# EAGLE design receiver (EAGLE 6.5.0)

## Sheet 1 of 5: Raspberry PI 2 Extention Board Documentation <http://elinux.org/RPi_Low-level_peripherals#Model_A.2B.2C_B.2B_and_B2>
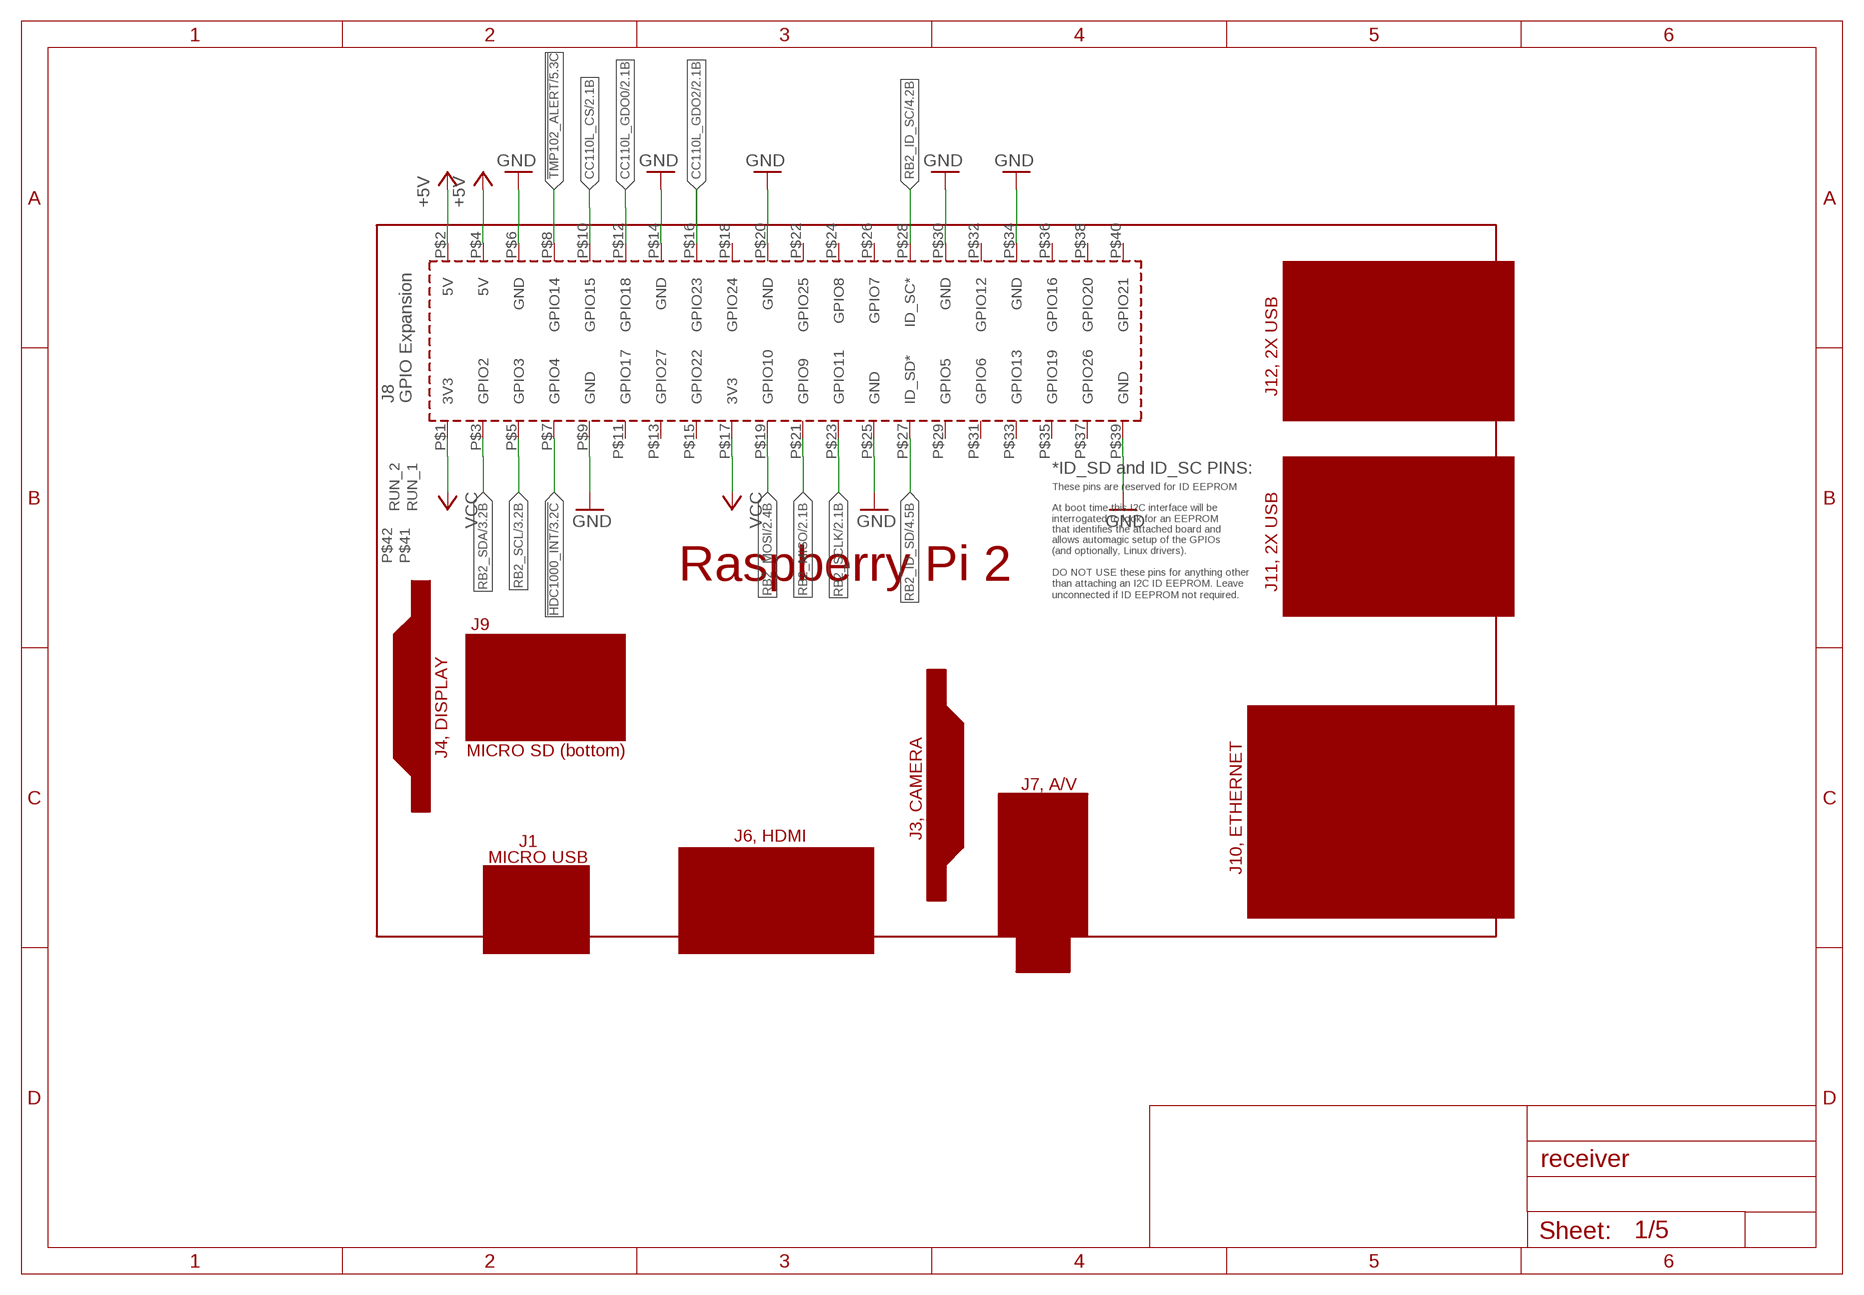
[diagram p0: schematic, sheet 1]

### Parts
PCB1  RPI2  [RPI2]

### Nets
!HDC1000_INT: PCB1.P$7(GPIO4) ; also sheet 3
!TMP102_ALERT: PCB1.P$8(GPIO14) ; also sheet 5
+5V: PCB1.P$2(5V) PCB1.P$4(5V)
CC110L_CS: PCB1.P$10(GPIO15) ; also sheet 2
CC110L_GDO0: PCB1.P$12(GPIO18) ; also sheet 2
CC110L_GDO2: PCB1.P$16(GPIO23) ; also sheet 2
GND: PCB1.P$6(GND) PCB1.P$9(GND) PCB1.P$14(GND) PCB1.P$20(GND) PCB1.P$25(GND) PCB1.P$30(GND) PCB1.P$34(GND) PCB1.P$39(GND) ; also sheet 2,3,4,5
RB2_ID_SC: PCB1.P$28(ID_SC*) ; also sheet 4
RB2_ID_SD: PCB1.P$27(ID_SD*) ; also sheet 4
RB2_MISO: PCB1.P$21(GPIO9) ; also sheet 2
RB2_MOSI: PCB1.P$19(GPIO10) ; also sheet 2
RB2_SCL: PCB1.P$5(GPIO3) ; also sheet 3,5
RB2_SCLK: PCB1.P$23(GPIO11) ; also sheet 2
RB2_SDA: PCB1.P$3(GPIO2) ; also sheet 3,5
VCC: PCB1.P$1(3V3) PCB1.P$17(3V3) ; also sheet 2,3,4,5
Unconnected: PCB1.P$11(GPIO17) PCB1.P$13(GPIO27) PCB1.P$15(GPIO22) PCB1.P$18(GPIO24) PCB1.P$22(GPIO25) PCB1.P$24(GPIO8) PCB1.P$26(GPIO7) PCB1.P$29(GPIO5) PCB1.P$31(GPIO6) PCB1.P$32(GPIO12) PCB1.P$33(GPIO13) PCB1.P$35(GPIO19) PCB1.P$36(GPIO16) PCB1.P$37(GPIO26) PCB1.P$38(GPIO20) PCB1.P$40(GPIO21) PCB1.P$41(RUN_1) PCB1.P$42(RUN_2)

## Sheet 2 of 5: Transceiver CC110L Datasheet <http://www.ti.com/lit/ds/symlink/cc110l.pdf>
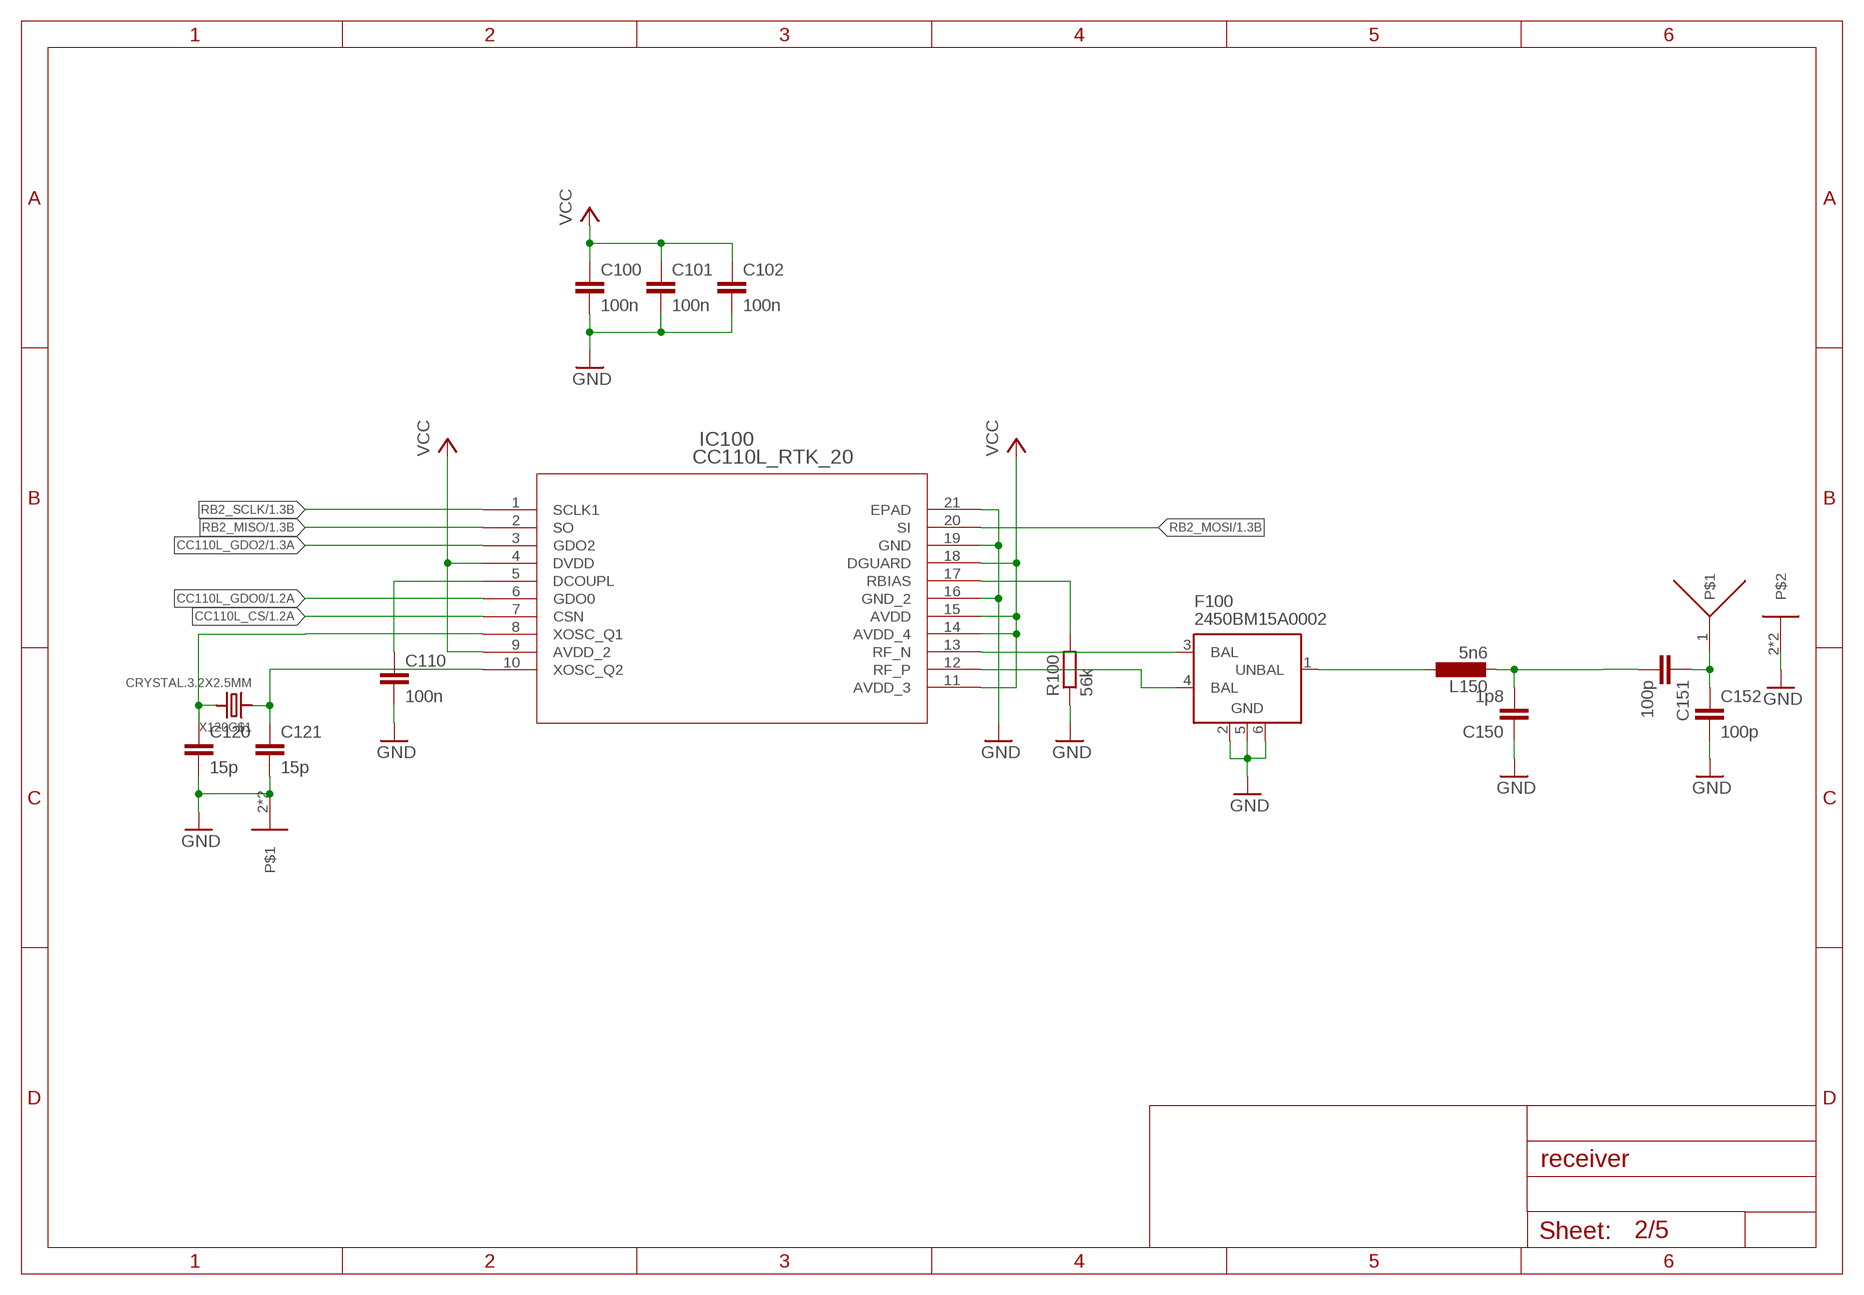
[diagram p1: schematic, sheet 2]

### Parts
C100  100n  C-EUC0603  [C0603]
C101  100n  C-EUC0603  [C0603]
C102  100n  C-EUC0603  [C0603]
C110  100n  C-EUC0603  [C0603]
C120  15p  C-EUC0603  [C0603]
C121  15p  C-EUC0603  [C0603]
C150  1p8  C-EUC0603K  [C0603K]
C151  100p  C-EUC0603  [C0603]
C152  100p  C-EUC0603K  [C0603K]
F100  2450BM15A0002  [2450BM15A0002]
IC100  CC110L_RTK_20  [RTK20_2P4X2P4]
L150  5n6  L-EUL2012C  [L2012C]
R100  56k  R-EU_R0603  [R0603]
U$1  ANTENNA868W3013-INV  [W3013-INV]
X120  CRYSTAL.3.2X2.5MM  [3.2X2.5MM]

### Nets
CC110L_CS: IC100.7(CSN) ; also sheet 1
CC110L_GDO0: IC100.6(GDO0) ; also sheet 1
CC110L_GDO2: IC100.3(GDO2) ; also sheet 1
GND: C100.2 C101.2 C102.2 C110.2 C120.2 C121.2 C150.1 C152.2 F100.2(GND) F100.5(GND) F100.6(GND) IC100.16(GND_2) IC100.19(GND) IC100.21(EPAD) R100.1 U$1.2 U$1.3 X120.2 X120.4 ; also sheet 1,3,4,5
N$2: C151.1 C152.1 U$1.1
N$29: C120.1 IC100.8(XOSC_Q1) X120.3
N$33: F100.1(UNBAL) L150.1
N$34: F100.3(BAL) IC100.13(RF_N)
N$35: F100.4(BAL) IC100.12(RF_P)
N$36: C150.2 C151.2 L150.2
N$40: C110.1 IC100.5(DCOUPL)
N$41: IC100.17(RBIAS) R100.2
N$49: C121.1 IC100.10(XOSC_Q2) X120.1
RB2_MISO: IC100.2(SO) ; also sheet 1
RB2_MOSI: IC100.20(SI) ; also sheet 1
RB2_SCLK: IC100.1(SCLK1) ; also sheet 1
VCC: C100.1 C101.1 C102.1 IC100.4(DVDD) IC100.9(AVDD_2) IC100.11(AVDD_3) IC100.14(AVDD_4) IC100.15(AVDD) IC100.18(DGUARD) ; also sheet 1,3,4,5

## Sheet 3 of 5: Humidity and Temperature Sensor HDC1000 Datascheet <http://www.ti.com/lit/ds/symlink/hdc1000.pdf>
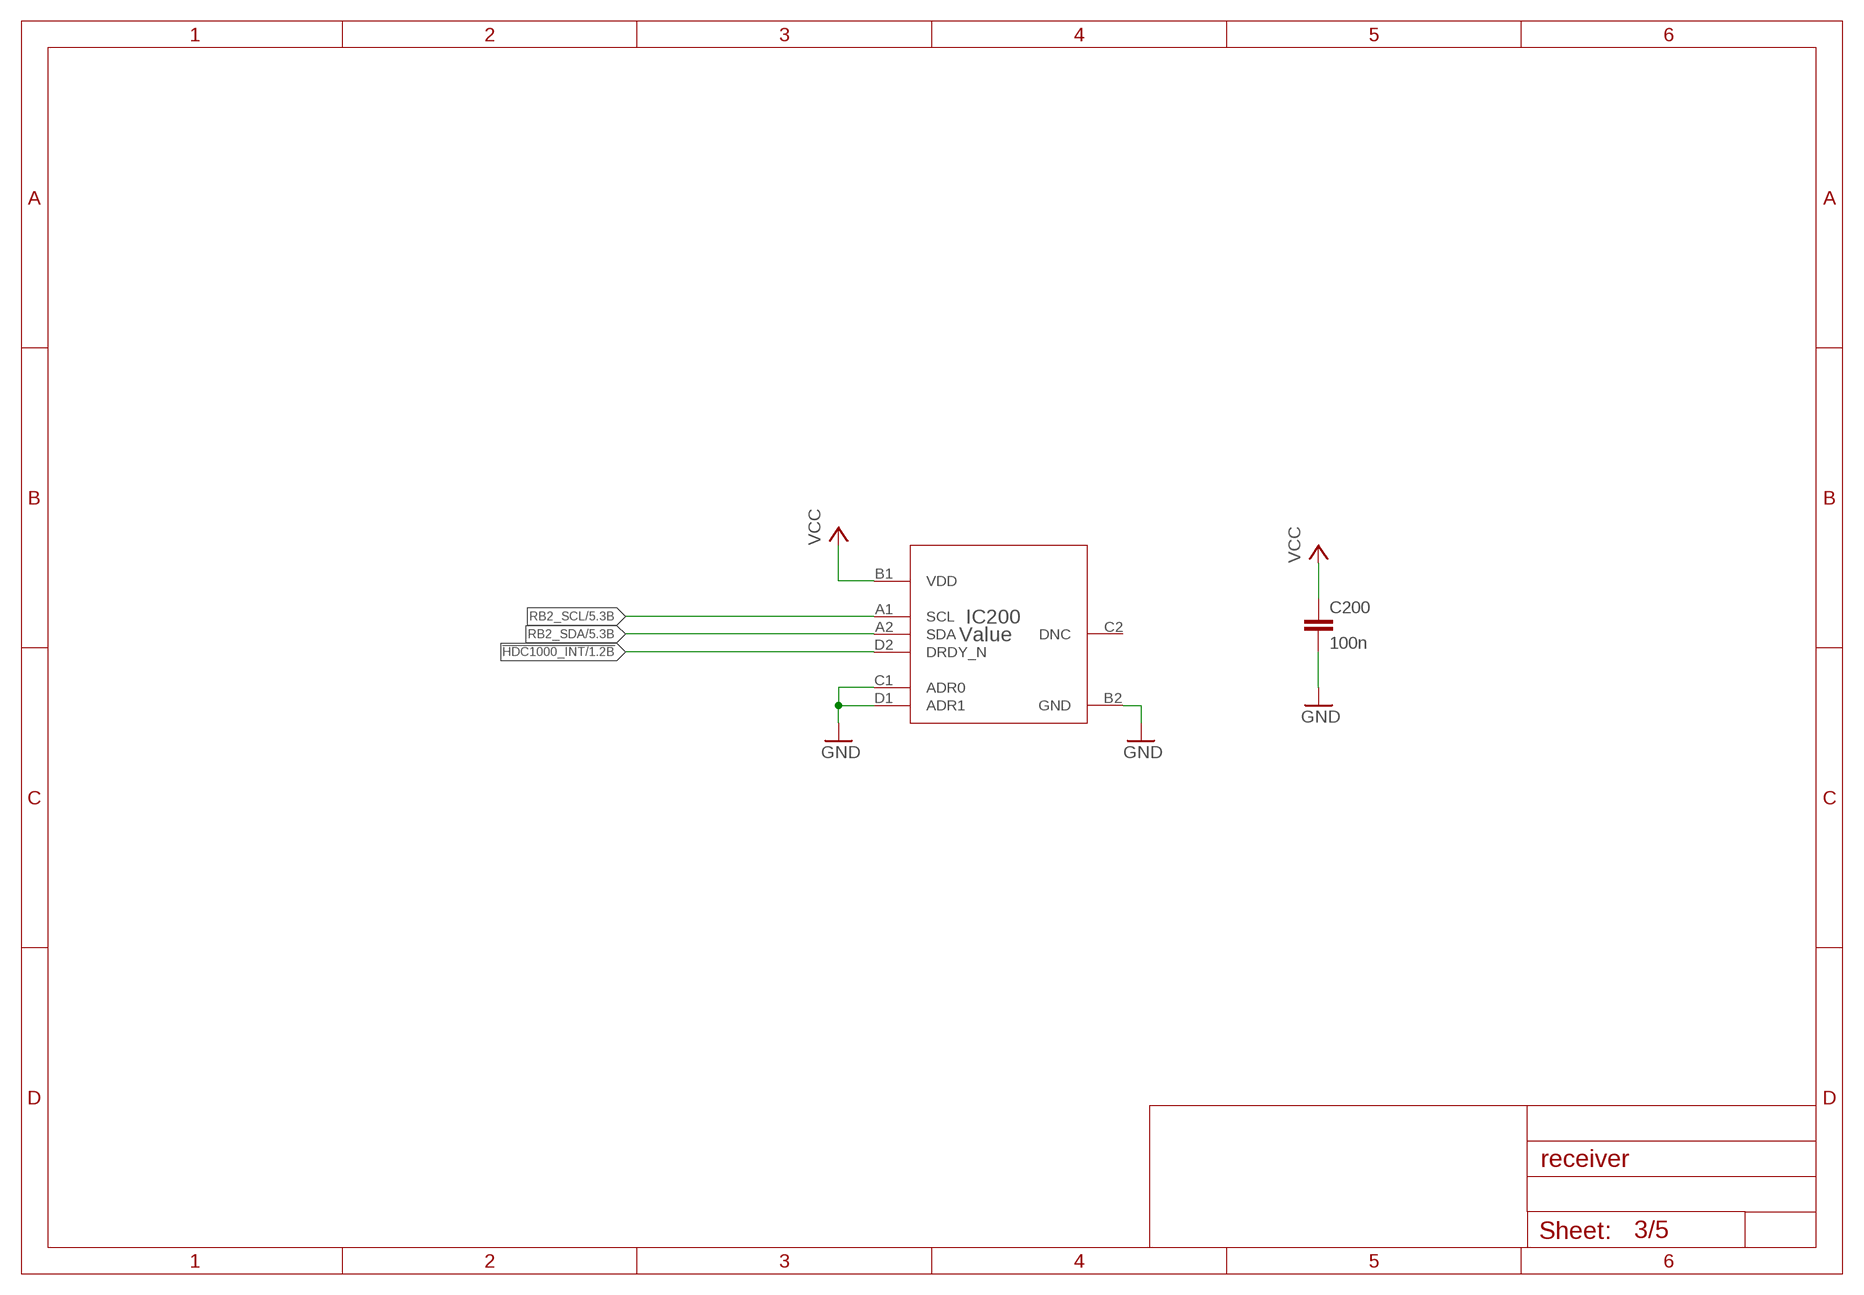
[diagram p2: schematic, sheet 3]

### Parts
C200  100n  C-EUC0603  [C0603]
IC200  Value  HDC1000YPAR  [YPA0008AGAE]

### Nets
!HDC1000_INT: IC200.D2(DRDY_N) ; also sheet 1
GND: C200.2 IC200.B2(GND) IC200.C1(ADR0) IC200.D1(ADR1) ; also sheet 1,2,4,5
RB2_SCL: IC200.A1(SCL) ; also sheet 1,5
RB2_SDA: IC200.A2(SDA) ; also sheet 1,5
VCC: C200.1 IC200.B1(VDD) ; also sheet 1,2,4,5
Unconnected: IC200.C2(DNC)

## Sheet 4 of 5: EEPROM CAT24C32WI Datasheet <http://www.onsemi.com/pub_link/Collateral/CAT24C32-D.PDF>
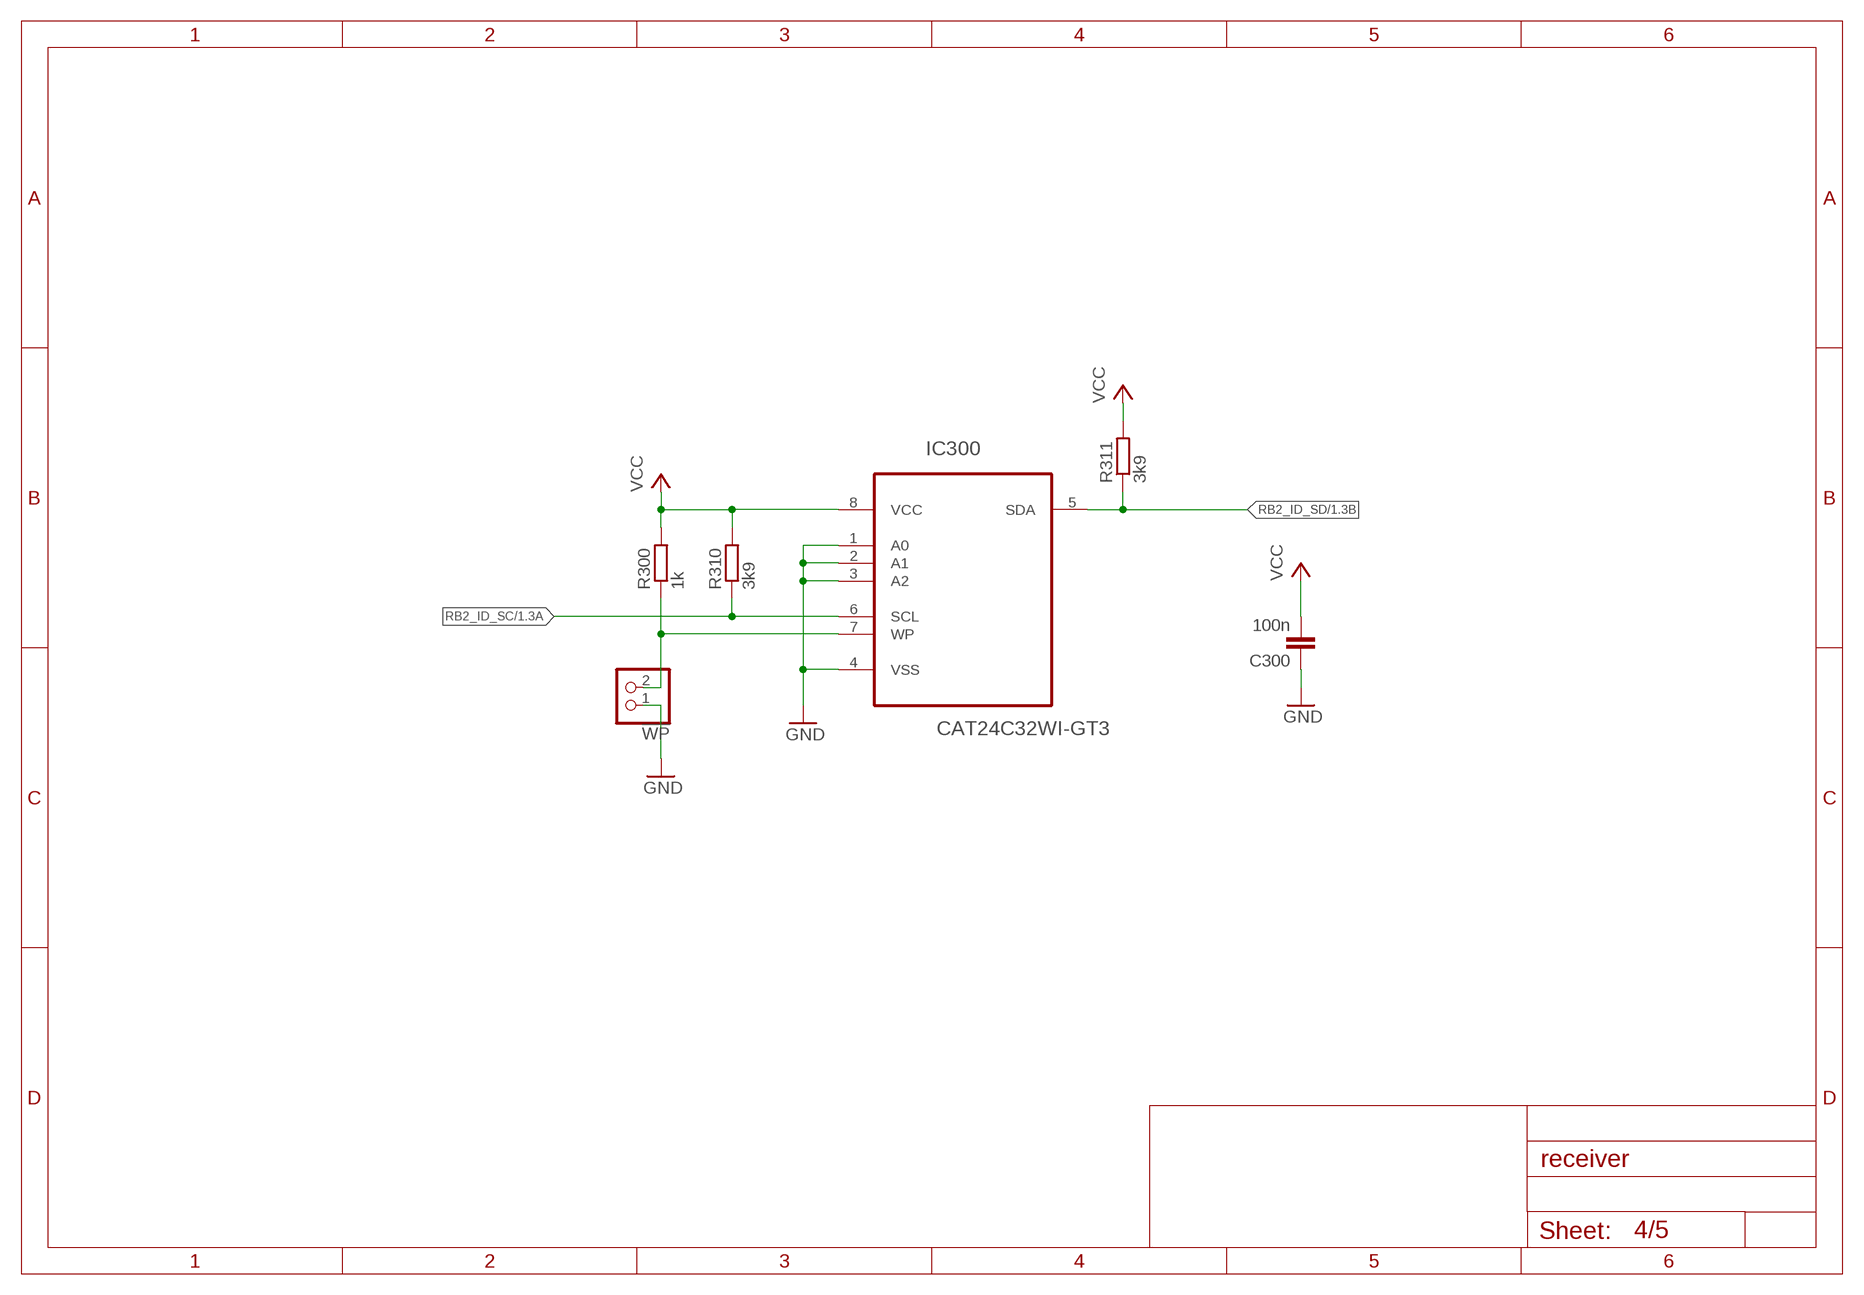
[diagram p3: schematic, sheet 4]

### Parts
!WP  PINHD-1X2  [1X02]
C300  100n  C-EUC0603  [C0603]
IC300  CAT24C32WI-GT3  [SOIC127P600X175-8N]
R300  1k  R-EU_R0603  [R0603]
R310  3k9  R-EU_R0603  [R0603]
R311  3k9  R-EU_R0603  [R0603]

### Nets
GND: !WP.1 C300.1 IC300.1(A0) IC300.2(A1) IC300.3(A2) IC300.4(VSS) ; also sheet 1,2,3,5
N$1: !WP.2 IC300.7(WP) R300.1
RB2_ID_SC: IC300.6(SCL) R310.1 ; also sheet 1
RB2_ID_SD: IC300.5(SDA) R311.1 ; also sheet 1
VCC: C300.2 IC300.8(VCC) R300.2 R310.2 R311.2 ; also sheet 1,2,3,5

## Sheet 5 of 5: Temperature Sensor Datasheet <http://www.ti.com/lit/ds/symlink/tmp102-q1.pdf>
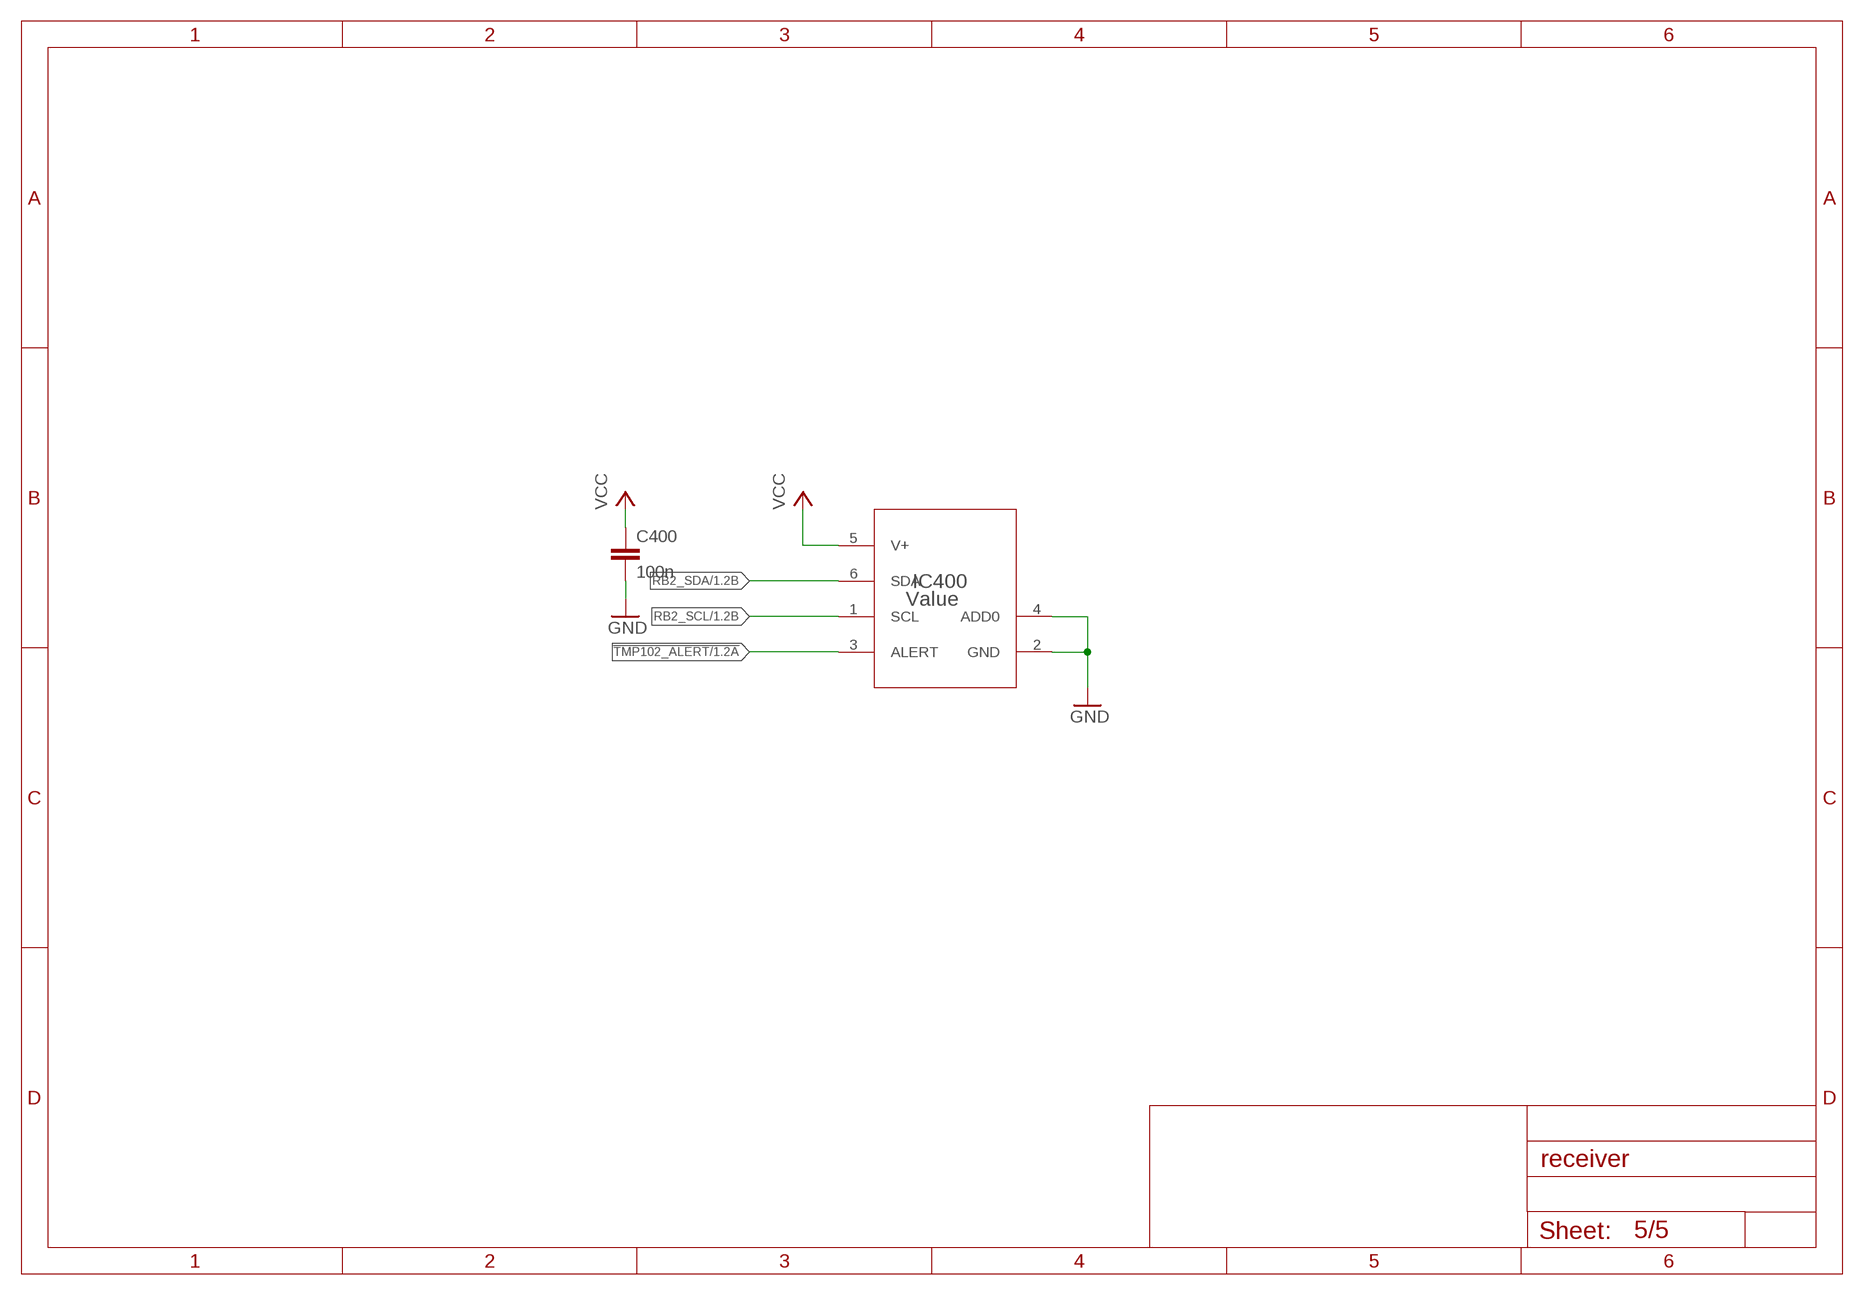
[diagram p4: schematic, sheet 5]

### Parts
C400  100n  C-EUC0603  [C0603]
IC400  Value  TMP102AQDRLRQ1  [DRL0006A]

### Nets
!TMP102_ALERT: IC400.3(ALERT) ; also sheet 1
GND: C400.2 IC400.2(GND) IC400.4(ADD0) ; also sheet 1,2,3,4
RB2_SCL: IC400.1(SCL) ; also sheet 1,3
RB2_SDA: IC400.6(SDA) ; also sheet 1,3
VCC: C400.1 IC400.5(V+) ; also sheet 1,2,3,4

## Library data of the parts
!WP = pinhead:PINHD-1X2: PIN HEADER
C100-C102 C110 C120 C121 C150-C152 C200 C300 C400 = rcl:C-EU: CAPACITOR, European symbol
F100 = johanson-technology:2450BM15A0002: 2.45 GHz Impedance Matched Balun-Filter For TI CC253X/CC2540 Chipset family Data sheet <http://www.johansontechnology.com/images/stories/ip/baluns/balun_filter_combo_matched_2450bm15a0002_v8.pdf>
IC100 = weather_station:CC110L_RTK_20; DATASHEETURL: http://www.ti.com/lit/gpn/CC110L; DESCRIPTION: Value Line Transceiver; FAMILY_NAME: SUB-1 GHZ; GENERIC_PART_NUMBER: CC110L; INDUSTRY_STD_PKG_TYPE: VQFN; MANUFACTURER: Texas Instruments; PACKAGE_DESIGNATOR: RTK; PIN_COUNT: 20
IC200 = weather_station:HDC1000YPAR; ALTERNATEPARTNUMBER: HDC1000YPAT; COMPTYPE: IC; MANUFACTURER: Texas Instruments; MOUNTTYPE: SMT; PACKAGEREFERENCE: YPA0008AGAE; PARTNUMBER: HDC1000YPAR; PIN_COUNT: 8; REFDES: RefDes; ROHS: Y; TYPE: TYPE
IC300 = weather_station:CAT24C32WI-GT3: 32-Kb I2C CMOS Serial EEPROM; MPN: CAT24C32WI-GT3; OC_FARNELL: 1718129; OC_NEWARK: 08R5414; PACKAGE: SOIC-8; SUPPLIER: CATALYST SEMICONDUCTOR
IC400 = weather_station:TMP102AQDRLRQ1; COMPTYPE: IC; MANUFACTURER: Texas Instruments; MOUNTTYPE: SMT; PACKAGEREFERENCE: DRL0006A; PARTNUMBER: TMP102AQDRLRQ1; PIN_COUNT: 6; REFDES: RefDes; ROHS: Y; TYPE: TYPE
L150 = rcl:L-EU: INDUCTOR, European symbol
PCB1 = weather_station:RPI2: Device for Raspberry Pi 2 board created by www.element14.com More information and support community is available at http://www.element14.com/community/community/raspberry-pi/raspberrypi2
R100 R300 R310 R311 = rcl:R-EU_: RESISTOR, European symbol
U$1 = weather_station:ANTENNA868
X120 = abracon:CRYSTAL

## Board
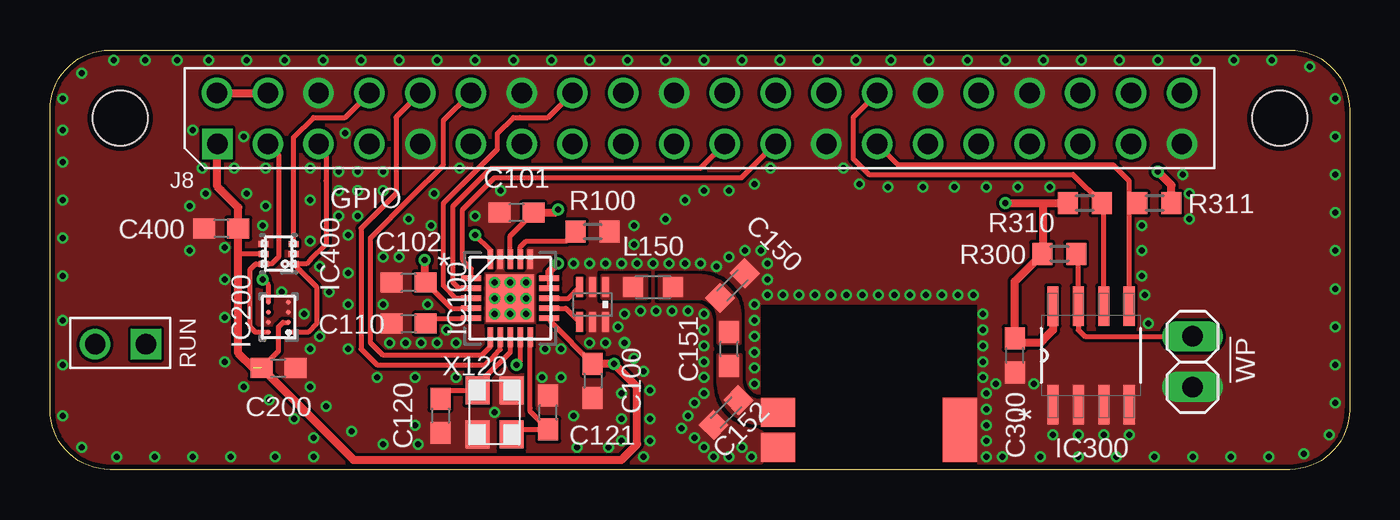
[diagram p5: board, top side]
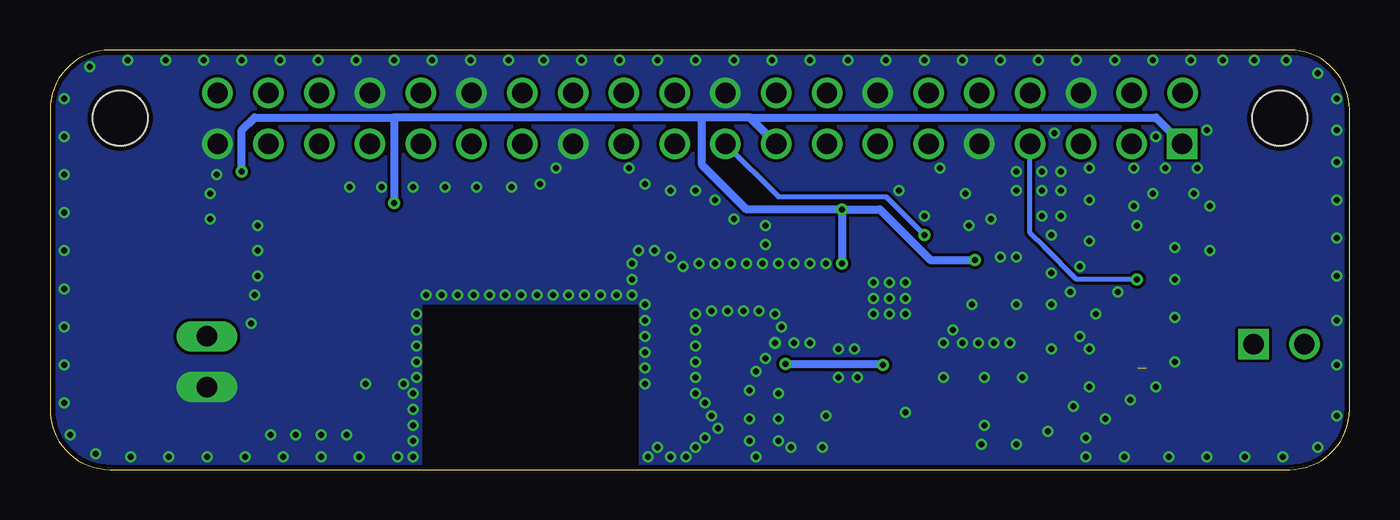
[diagram p6: board, bottom side, seen from below]

Size 65 x 21 mm. Coordinates in mm from the lower left corner, seen from the top.
Outline: 0,18 arc-90 3,21 62,21 arc-90 65,18 65,3 arc-90 62,0 3,0 arc-90 0,3 0,18
Copper layers (1*16): Top 0.018mm / dielectric 1.55mm / Bottom 0.018mm
Design rules "eC_2Layer_PClass6_BaseCopperO18_eCDefault *": minimum track width 0.15mm, minimum drill 0.3mm, track to track 0.15mm, track to pad 0.15mm, pad to pad 0.15mm, via to via 0.15mm, smd to smd 0.15mm, copper to edge 0.25mm, drill to drill 0.35mm, minimum pad ring 0.175mm, minimum via ring 0.125mm, stop-mask expansion 0mil, vias tented up to drill 0.45mm, thermal gap 0.2mm

### Footprints (pad centres in the part's own frame; a part is rotated, then mirrored left to right if it is on the bottom)
1X02 = drill 1.016 long: 1 -1.27,0; 2 1.27,0
C0603 = smd 1.1 x 1: 1 -0.85,0; 2 0.85,0
C0603K = smd 1.05 x 1.08: 1 -0.875,0; 2 0.875,0
2450BM15A0002 = smd 0.35 x 1: 1 -0.65,-0.875; 2 0,-0.875; 3 0.65,-0.875; 4 0.65,0.875; 5 0,0.875; 6 -0.65,0.875
RTK20_2P4X2P4 = smd 0.991 x 0.279: 1 -1.95,1; 2 -1.95,0.5; 3 -1.95,0; 4 -1.95,-0.5; 5 -1.95,-1; 11 1.95,-1; 12 1.95,-0.5; 13 1.95,0; 14 1.95,0.5; 15 1.95,1 | smd 0.279 x 0.991: 6 -1,-1.95; 7 -0.5,-1.95; 8 0,-1.95; 9 0.5,-1.95; 10 1,-1.95; 16 1,1.95; 17 0.5,1.95; 18 0,1.95; 19 -0.5,1.95; 20 -1,1.95 | smd 2.388 x 2.388: 21 0,0
YPA0008AGAE = smd 0.254 x 0.254: A1 -0.5,0.75; A2 0.5,0.75; B1 -0.5,0.25; B2 0.5,0.25; C1 -0.5,-0.25; C2 0.5,-0.25; D1 -0.5,-0.75; D2 0.5,-0.75
SOIC127P600X175-8N = smd 1.981 x 0.559: 1 -2.464,1.905; 2 -2.464,0.635; 3 -2.464,-0.635; 4 -2.464,-1.905; 5 2.464,-1.905; 6 2.464,-0.635; 7 2.464,0.635; 8 2.464,1.905
DRL0006A = smd 0.508 x 0.305: 1 -0.75,0.5; 2 -0.75,0; 3 -0.75,-0.5; 4 0.75,-0.5; 5 0.75,0; 6 0.75,0.5
L2012C = smd 1 x 1: 1 -1,0; 2 1,0
RPI2 = drill 1.016 square: P$1 8.37,51.23; P$41 4.8,41.2 | drill 1.016: P$2 8.357,53.772; P$3 10.897,51.232; P$4 10.897,53.772; P$5 13.437,51.232; P$6 13.437,53.772; P$7 15.977,51.232; P$8 15.977,53.772; P$9 18.517,51.232; P$10 18.517,53.772; P$11 21.057,51.232; P$12 21.057,53.772; P$13 23.597,51.232; P$14 23.597,53.772; P$15 26.137,51.232; P$16 26.137,53.772; P$17 28.677,51.232; P$18 28.677,53.772; P$19 31.217,51.232; P$20 31.217,53.772; P$21 33.757,51.232; P$22 33.757,53.772; P$23 36.297,51.232; P$24 36.297,53.772; P$25 38.837,51.232; P$26 38.837,53.772; P$27 41.377,51.232; P$28 41.377,53.772; P$29 43.917,51.232; P$30 43.917,53.772; P$31 46.457,51.232; P$32 46.457,53.772; P$33 48.997,51.232; P$34 48.997,53.772; P$35 51.537,51.232; P$36 51.537,53.772; P$37 54.077,51.232; P$38 54.077,53.772; P$39 56.617,51.232; P$40 56.617,53.772; P$42 2.26,41.2 | hole 2.75: 3.5,52.5; 61.5,52.5
R0603 = smd 1 x 1.1: 1 -0.85,0; 2 0.85,0
W3013-INV = smd 1.7 x 1.45: 1 0.845,2.875; 2 0.845,1.125 | smd 1.7 x 3.2: 3 9.945,2
3.2X2.5MM = smd 1.4 x 1.2: 1 -1.1,-0.85; 2 1.1,-0.85; 3 1.1,0.85; 4 -1.1,0.85

### Placement (x,y rotation side)
!WP  57.15,5.4 90 top
C100  27.15,4.45 270 top
C101  23.34,12.86 180 top
C102  17.94,9.37 180 top
C110  17.94,7.3 180 top
C120  19.53,2.7 270 top
C121  24.92,2.86 90 top
C150  34.13,9.21 225 top
C151  33.97,6.03 90 top
C152  33.81,2.86 225 top
C200  11.43,5.08 0 top
C300  48.26,5.71 90 top
C400  8.57,12.06 180 top
F100  27.15,8.26 180 top
IC100  23.02,8.57 0 top
IC200  11.43,7.62 180 top
IC300  52.07,5.71 90 top
IC400  11.43,10.79 180 top
L150  30.16,9.14 0 top
PCB1  0,-34.92 0 top
R100  27.15,11.91 180 top
R300  50.48,10.79 180 top
R310  51.75,13.34 180 top
R311  55.24,13.34 0 top
U$1  35.56,0 0 top
X120  22.23,2.86 90 top

### Tracks (layer width: path | path; a pad name or v marks a point on that pad's centre or on a via)
!HDC1000_INT  (via drill 0.3 pad 0.6)
  Top 0.254: IC200.D2 10.93,9.23 v10.64,9.53
  Bottom 0.254: v10.64,9.53 13.65,9.53 15.24,11.11 15.98,11.85 PCB1.P$7
!TMP102_ALERT
  Top 0.254: IC400.3 12.18,16.62 13.18,17.62 14.75,17.62 PCB1.P$8
+5V
  Top 0.406: PCB1.P$2 PCB1.P$4
CC110L_CS
  Top 0.254: PCB1.P$10 17.3,17.63 17.3,13.81 15.56,12.06 15.56,6.03 16.35,5.24 21.75,5.24 22.23,5.71 22.52,6.01 IC100.7
CC110L_GDO0
  Top 0.254: IC100.6 22.02,6.14 21.59,5.71 16.67,5.71 16.03,6.35 16.03,11.59 18.1,13.65 19.68,15.24 19.68,17.48 PCB1.P$12
CC110L_GDO2
  Top 0.254: IC100.3 20.32,8.57 19.68,9.21 19.68,10.48 19.68,13.34 22.38,16.03 22.38,16.83 23.18,17.62 23.5,17.62 24.91,17.62 PCB1.P$16
GND  (via drill 0.3, 0.3 pad 0.6)
  other vias: 26.19,2.7 35.24,4.29 35.24,5.08 35.24,5.87 35.24,6.67 35.24,7.46 28.73,6.35 35.24,8.26 35.88,8.73 36.67,8.73 37.47,8.73 40.64,8.73 38.26,8.73 39.05,8.73 39.85,8.73 22.23,8.57 22.23,9.37 41.43,8.73 22.23,7.78 42.23,8.73 43.02,8.73 43.81,8.73 44.61,8.73 18.26,2.22 45.4,8.73 46.2,8.73 46.67,7.78 46.67,6.99 46.67,6.19 22.23,2.86 46.67,5.4 46.67,4.6 46.83,3.81 46.83,3.02 24.77,6.03 46.83,2.22 46.83,1.43 46.83,0.64 35.08,0.64 34.61,1.11 33.97,0.64 29.21,5.56 32.23,3.33 18.41,1.27 32.7,3.81 32.7,4.6 32.7,5.4 32.7,6.19 32.7,6.99 32.7,7.78 29.69,4.92 31.91,7.94 31.11,7.94 30.32,7.94 29.53,7.94 26.19,10.32 28.73,7.78 28.42,7.14 26.99,6.35 27.78,6.35 6.99,13.18 13.02,6.03 26.99,10.32 27.78,10.32 28.57,10.32 13.02,4.13 29.37,10.32 30.16,10.32 30.96,10.32 31.75,10.32 32.54,10.32 33.34,10.16 6.99,10.95 35.88,9.53 33.97,10.64 35.88,10.32 34.77,10.95 35.56,10.95 31.91,2.7 31.59,2.06 32.23,1.59 32.7,1.11 33.18,0.64 23.02,9.37 23.02,8.57 23.81,8.57 23.81,9.37 23.81,7.78 23.02,7.78 10.64,12.22 12.7,7.78 13.02,11.43 13.02,13.49 11.59,8.89 16.67,8.26 16.99,6.35 17.78,6.35 18.57,6.35 19.37,6.35 19.84,6.99 21.27,12.7 30.8,12.54 22.54,13.97 29.21,12.22 29.21,11.27 47.31,4.29 49.21,4.29 50.16,1.75 51.44,1.75 52.7,1.75 53.98,1.75 13.02,15.08 16.67,10.64 17.46,10.64 6.35,20.48 4.76,20.48 3.17,20.48 1.59,19.84 0.64,18.57 0.64,16.99 0.64,15.4 0.64,13.49 0.64,11.59 0.64,9.68 0.64,7.46 0.64,5.24 0.64,2.7 1.59,1.11 3.33,0.64 5.24,0.64 7.14,0.64 9.05,0.64 11.27,0.64 13.18,0.64 16.67,1.27 15.08,1.91 13.81,3.17 20.32,4.6 18.26,4.6 16.35,4.6 14.92,6.03 14.92,8.26 14.92,9.84 14.92,11.75 15.4,12.7 13.49,10.16 13.97,8.89 13.49,6.67 20.48,15.08 19.21,13.81 17.94,12.54 19.05,12.22 20.32,6.35 18.89,8.26 7.94,20.48 9.84,20.48 11.75,20.48 13.65,20.48 15.56,20.48 17.46,20.48 19.37,20.48 21.27,20.48 23.18,20.48 25.08,20.48 26.99,20.48 28.89,20.48 10.79,15.08 9.21,15.08 9.84,13.81 9.68,16.67 13.18,1.59 12.22,2.54 10.95,3.49 9.68,4.13 8.73,5.4 8.73,7.62 8.73,9.53 8.73,11.11 7.78,13.81 7.62,15.08 7.14,16.99 25.56,6.03 24.61,4.6 25.56,4.6 28.57,3.81 28.57,2.54 28.57,1.43 27.94,1.11 26.35,1.11 30,3.97 30,2.54 30,1.43 29.69,0.64 31.75,13.49 32.7,13.97 33.97,13.97 35.24,14.29 36.04,15.08 30.8,20.48 32.7,20.48 34.61,20.48 36.51,20.48 38.42,20.48 40.32,20.48 15.4,14.92 15.4,13.97 16.67,13.97 16.67,14.92 14.76,16.83 14.45,14.92 14.45,13.97 14.45,12.7 10.79,13.18 39.69,15.08 40.48,14.29 41.91,14.13 43.66,14.13 45.24,14.13 46.83,14.13 48.42,14.13 50.01,14.13 42.07,20.48 43.97,20.48 45.88,20.48 47.78,20.48 49.69,20.48 51.59,20.48 53.5,20.48 55.4,20.48 57.31,20.48 59.21,20.48 61.12,20.48 63.02,20.16 64.29,18.57 64.29,16.67 64.29,14.76 64.29,12.86 64.29,10.95 64.29,9.05 64.29,7.14 64.29,5.24 64.29,3.33 63.98,1.75 62.71,0.79 60.96,0.64 59.05,0.64 57.15,0.64 55.24,0.64 53.34,0.64 51.44,0.64 49.53,0.64 47.62,0.64 56.67,14.76 56.99,13.81 56.99,12.54 54.61,12.22 54.61,10.95 54.61,9.68 54.77,8.73 54.93,7.3
  pour Top (isolate 0.15, rank 3, no thermals): 0,20.95 0,0 65.09,0 65.09,20.95
  pour Bottom (no thermals): 0,20.95 0,0 65.09,0 65.09,20.95
  pour Top (rank 2, no thermals): 34.92,9.21 46.99,9.21 46.99,0 34.92,0
N$1
  Top 0.254: R300.1 51.44,10.69 IC300.7 51.44,6.99 51.75,6.67 56.52,6.67 !WP.2
N$2
  pour Top (isolate 0.2, no thermals): 33.42,5.71 33.42,4.42 arc90 35.52,2.33 35.88,2.33 35.88,3.42 35.55,3.42 arc-90 34.55,4.42 34.55,5.71
N$29
  Top 0.254: C120.1 19.93,3.96 X120.3 21.75,4.33 21.75,4.6 23.02,5.87 IC100.8
N$33
  pour Top (isolate 0.2, no thermals): 27.62,9.69 27.62,8.59 29.84,8.59 29.84,9.69
N$34
  Top 0.254: IC100.13 25.94,8.57 F100.3
N$35
  Top 0.254: IC100.12 25.8,8.07 F100.4
N$36
  pour Top (isolate 0.2, no thermals): 30.48,9.69 30.48,8.59 32.42,8.59 arc-90 33.42,7.59 33.42,6.35 34.52,6.35 34.52,7.59 arc90 32.42,9.69
N$40
  Top 0.254: C110.1 19.06,7.57 IC100.5
N$41
  Top 0.254: IC100.17 23.52,11.14 23.81,11.43 25.82,11.43 R100.2
N$49
  Top 0.254: X120.1 23.32,2.01 C121.1 24.02,2.91 24.02,3.07 IC100.10
RB2_ID_SC
  Top 0.254: IC300.6 52.7,13.23 R310.1 51.17,14.76 40.96,14.76 40.16,15.56 40.16,17.62 41.38,18.83 PCB1.P$28
RB2_ID_SD
  Top 0.254: IC300.5 53.98,12.91 | 53.98,12.91 R311.1 | 53.98,12.91 53.98,14.45 53.18,15.24 52.55,15.24 51.59,15.24 42.53,15.24 42.44,15.24 42.37,15.31 PCB1.P$27
RB2_MISO
  Top 0.254: IC100.2 20.45,9.07 20.16,9.37 20.16,10.79 20.16,13.18 22.07,15.08 32.53,15.08 PCB1.P$21
RB2_MOSI  (via drill 0.3 pad 0.6)
  Top 0.254: v21.27,11.75 22.02,11 IC100.20
  Bottom 0.254: PCB1.P$19 31.22,16.29 28.57,13.65 23.18,13.65 v21.27,11.75
RB2_SCL
  Top 0.254: IC200.A1 12.9,6.87 13.34,7.3 13.34,9.14 IC400.1 12.84,10.29 13.02,10.48 13.81,11.27 13.81,14.45 13.81,15.93 PCB1.P$5
RB2_SCLK
  Top 0.254: IC100.1 21.07,10.05 20.64,10.48 20.64,10.79 20.64,13.02 22.23,14.61 34.59,14.61 PCB1.P$23
RB2_SDA
  Top 0.254: IC200.A2 10.28,6.87 10,7.14 10,10 10.16,10.16 10.29,10.29 IC400.6 11.09,10.29 11.43,10.64 11.43,15.77 PCB1.P$3
VCC  (via drill 0.3 pad 0.6)  (1 unrouted)
  Top 0.254: IC400.5 9.53,10.79 9.45,10.79 9.42,10.77 | C200.1 11.43,5.93 11.43,6.99 11.43,7.14 11.66,7.37 IC200.B1 | C102.1 20.08,8.07 IC100.4 | IC100.11 25.03,7.57 25.03,7.41 C100.1 | IC100.9 23.52,5.42 v23.34,5.24 | IC100.15 IC100.14 | IC100.18 23.02,11.69 C101.1 | C400.1 9.53,11.96
  Top 0.406: v47.78,13.34 49.69,13.34 | 49.69,13.34 R310.2 | 49.69,13.34 49.69,10.85 R300.2 48.26,9.42 C300.2 48.48,6.35 49.53,6.35 49.85,6.67 50.16,6.99 IC300.8 | R311.2 56.09,14.23 v55.4,14.92 | C101.1 25.24,12.86 v25.4,13.02 | 10.16,5.08 9.42,5.82 9.42,10.77 C400.1 9.42,13.12 8.57,13.97 8.37,14.17 PCB1.P$1 | v25.4,10.32 24.97,9.89 IC100.15 | C200.1 15.18,0.48 25.24,0.48 28.57,0.48 29.37,1.27 29.37,4.13 v28.2,5.29 C100.1 | v18.73,10.48 18.73,9.42 C102.1
  Bottom 0.406: PCB1.P$17 29.99,17.62 | 29.99,17.62 32.38,17.62 | 32.38,17.62 47.78,17.62 | 47.78,17.62 47.78,17.3 47.78,16.51 47.78,14.61 v47.78,13.34 | v55.4,14.92 55.4,16.99 54.77,17.62 47.78,17.62 | v25.4,13.02 30.16,13.02 32.38,15.24 32.38,17.62 | 29.99,17.62 9.69,17.62 PCB1.P$1 | v25.4,13.02 v25.4,10.32 | v25.4,13.02 23.5,13.02 20.95,10.48 v18.73,10.48 | v28.2,5.29 23.39,5.29 v23.34,5.24